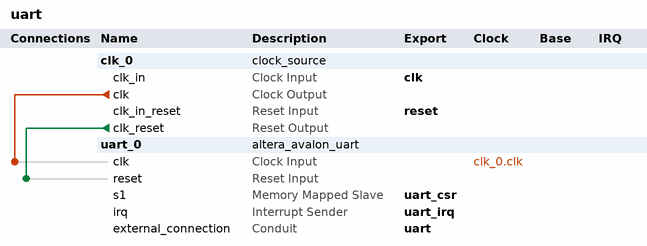
[diagram p0: system contents]
# Platform Designer (Qsys) system uart, Cyclone V 5CGXFC7C7F23C8
# Parameters at their usual value, and those the tool derives, are not listed.
package require -exact qsys 18.1
create_system uart
set_project_property DEVICE_FAMILY {Cyclone V}
set_project_property DEVICE 5CGXFC7C7F23C8

add_instance clk_0 clock_source 18.1
set_instance_parameter_value clk_0 clockFrequency 50000000

add_instance uart_0 altera_avalon_uart 18.1
set_instance_parameter_value uart_0 baud 115200
set_instance_parameter_value uart_0 dataBits 8
set_instance_parameter_value uart_0 fixedBaud true
set_instance_parameter_value uart_0 parity NONE
set_instance_parameter_value uart_0 stopBits 1

# connections
add_connection clk_0.clk uart_0.clk clock
add_connection clk_0.clk_reset uart_0.reset reset

# exported interfaces
add_interface clk clock sink
set_interface_property clk EXPORT_OF clk_0.clk_in
add_interface reset reset sink
set_interface_property reset EXPORT_OF clk_0.clk_in_reset
add_interface uart conduit end
set_interface_property uart EXPORT_OF uart_0.external_connection
add_interface uart_csr avalon slave
set_interface_property uart_csr EXPORT_OF uart_0.s1
add_interface uart_irq interrupt sender
set_interface_property uart_irq EXPORT_OF uart_0.irq

set_interconnect_requirement {$system} qsys_mm.clockCrossingAdapter HANDSHAKE
set_interconnect_requirement {$system} qsys_mm.enableEccProtection FALSE
set_interconnect_requirement {$system} qsys_mm.insertDefaultSlave FALSE
set_interconnect_requirement {$system} qsys_mm.maxAdditionalLatency 1

save_system uart.qsys
